# Altium schematic sheet temperature.SchDoc
size A4; DocumentNumber: 5; SheetNumber: 5; SheetTotal: 7
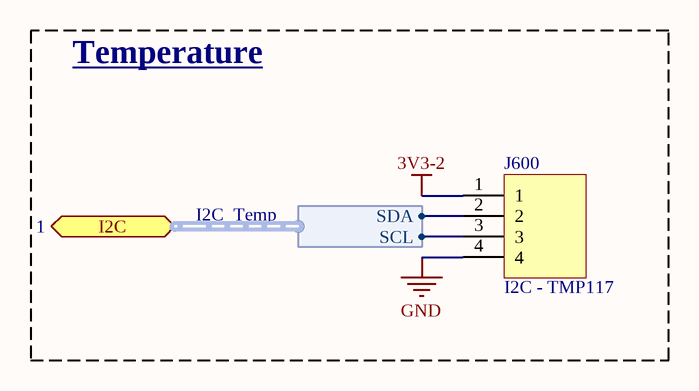
[diagram p0: temperature.SchDoc]

## Parts
J600  I2C - TMP117  [JST_S4B-PH-K-S(LF)(SN)]

## Blocks framed on the sheet
Temperature: J600

## Ports
I2C (bidir, harness I2C_Temp, see 1)

## Harnesses
I2C_Temp: SDA, SCL

## Nets
3V3-2: J600.1
GND: J600.4
NetJ600_2: J600.2 ; port I2C.SDA
NetJ600_3: J600.3 ; port I2C.SCL

## Notes on the sheet
- Author
- Version
- Revision
- of

## Library data of the parts
J600 = CON4